# Altium schematic sheet Top_Design.SchDoc
size A4; SheetNumber: 1; SheetTotal: 4
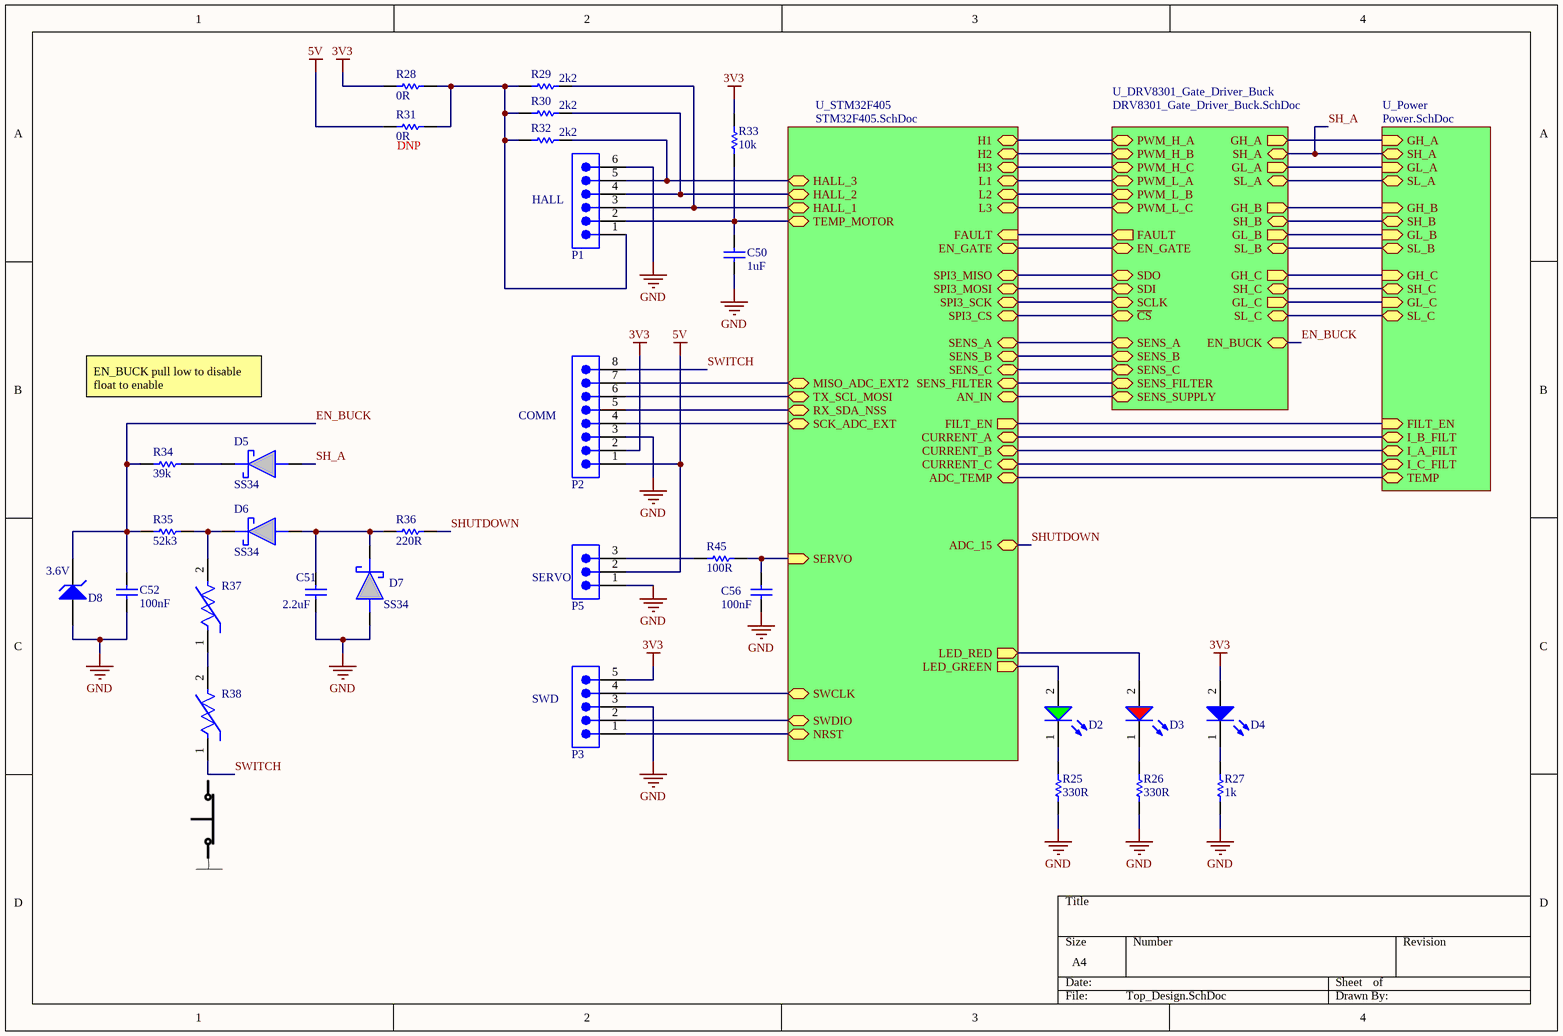
[diagram p0: Top_Design.SchDoc]

## Parts
C50  value 1uF  [Wurth 0603 capacitor]  (hidden comment: Generic Capacitor 1uF 0603)
C51  value 2.2uF  [Wurth 0603 capacitor]  (hidden comment: Generic Capacitor 2.2uF 0603)
C52  value 100nF  [Wurth 0603 capacitor]  (hidden comment: Generic Capacitor 100nF 0603)
C56  value 100nF  [Wurth 0603 capacitor]  (hidden comment: Generic Capacitor 100nF 0603)
D2  Green, 3.2V, 140°  [Wurth 0603 LED]  (value not drawn)
D3  Red, 2V, 140°  [Wurth 0603 LED]  (value not drawn)
D4  Blue, 3.2V, 140°  [Wurth 0603 LED]  (value not drawn)
D5  SS34  [MDD DO-214AC diode]
D6  SS34  [MDD DO-214AC diode]
D7  SS34  [MDD DO-214AC diode]
D8  ROHM EDZVT2R3.6B  [ROHM SOD-523 zener]  (value not drawn)
P1  61300611121  [6x1 2.54mm M]  (value not drawn)
P2  61300811121  [8x1 2.54mm M]  (value not drawn)
P3  61300511121  [5x1 2.54mm M]  (value not drawn)
P5  61300311121  [3x1 2.54mm M]  (value not drawn)
R25  value 330R  [Wurth 0603 Resistor]  (hidden comment: Generic Resistor 330R 0603)
R26  value 330R  [Wurth 0603 Resistor]  (hidden comment: Generic Resistor 330R 0603)
R27  value 1k  [Wurth 0603 Resistor]  (hidden comment: Generic Resistor 1k 0603)
R28  value 0R  [Wurth 0603 Resistor]  (hidden comment: Generic Resistor 0R 0603)
R29  value 2k2  [Wurth 0603 Resistor]  (hidden comment: Generic Resistor 2k2 0603)
R30  value 2k2  [Wurth 0603 Resistor]  (hidden comment: Generic Resistor 2k2 0603)
R31  value 0R  [Wurth 0603 Resistor]  (hidden comment: Generic Resistor 0R 0603)
R32  value 2k2  [Wurth 0603 Resistor]  (hidden comment: Generic Resistor 2k2 0603)
R33  value 10k  [Wurth 0603 Resistor]  (hidden comment: Generic Resistor 10k 0603)
R34  value 39k  [Wurth 0603 Resistor]  (hidden comment: Generic Resistor 39k 0603)
R35  value 52k3  [Wurth 0603 Resistor]  (hidden comment: Generic Resistor 52k3 0603)
R36  value 220R  [Wurth 0603 Resistor]  (hidden comment: Generic Resistor 220R 0603)
R37  PRF15BC102RB6RC  [FP-PRF15-0_05-IPC_B]  (value not drawn)
R38  PRF15BC102RB6RC  [FP-PRF15-0_05-IPC_B]  (value not drawn)
R45  value 100R  [Wurth 0603 Resistor]  (hidden comment: Generic Resistor 100R 0603)

## Sub-sheets
U_DRV8301_Gate_Driver_Buck = DRV8301_Gate_Driver_Buck.SchDoc: GH_A (out), GH_B (out), GH_C (out), GL_A (out), GL_B (out), GL_C (out), SCLK (bidir), SDI (bidir), SDO (bidir), ~{CS} (bidir), SH_A (bidir), SL_A (bidir), SL_B (bidir), SL_C (bidir), PWM_L_A (bidir), PWM_L_B (bidir), PWM_L_C (bidir), PWM_H_C (bidir), PWM_H_B (bidir), PWM_H_A (bidir), SH_C (bidir), SH_B (bidir), EN_BUCK (bidir), SENS_A (bidir), SENS_B (bidir), SENS_C (bidir), EN_GATE (bidir), SENS_FILTER (bidir), SENS_SUPPLY (bidir), FAULT (out)
U_Power = Power.SchDoc: GH_A (in), GL_A (in), GH_B (in), GL_B (in), GH_C (in), GL_C (in), SH_A (bidir), SL_A (bidir), SH_B (bidir), SL_B (bidir), SH_C (bidir), SL_C (bidir), I_A_FILT (bidir), I_B_FILT (bidir), I_C_FILT (bidir), FILT_EN (in), TEMP (bidir)
U_STM32F405 = STM32F405.SchDoc: EN_GATE (bidir), RX_SDA_NSS (bidir), L1 (bidir), L2 (bidir), L3 (bidir), SENS_A (bidir), SENS_B (bidir), SENS_C (bidir), ADC_TEMP (bidir), SCK_ADC_EXT (bidir), H1 (bidir), H2 (bidir), H3 (bidir), SWDIO (bidir), SWCLK (bidir), CURRENT_A (bidir), CURRENT_B (bidir), CURRENT_C (bidir), AN_IN (bidir), TEMP_MOTOR (bidir), ADC_15 (bidir), HALL_1 (bidir), HALL_2 (bidir), HALL_3 (bidir), SPI3_CS (bidir), SPI3_SCK (bidir), SENS_FILTER (bidir), SPI3_MOSI (bidir), SPI3_MISO (bidir), LED_GREEN (out), LED_RED (out), MISO_ADC_EXT2 (bidir), TX_SCL_MOSI (bidir), FILT_EN (out), NRST (bidir), FAULT (in), SERVO (in)

## Nets
3V3: D4.2(A) P2.2 P3.5 R28.2 R33.2
5V: P2.1 P5.2 R31.2
GND: C50.1 C51.1 C52.1 C56.1 D7.2(A) D8.2(A) P1.6 P2.3 P3.3 P5.1 R25.2 R26.2 R27.2
EN_BUCK: C52.2 D8.1(K) R34.1 R35.1 ; sheet U_DRV8301_Gate_Driver_Buck/EN_BUCK
SH_A: D5.2(A) ; sheet U_DRV8301_Gate_Driver_Buck/SH_A, sheet U_Power/SH_A
SHUTDOWN: R36.2 ; sheet U_STM32F405/ADC_15
SWITCH: P2.8 R38.1
NetC50_2: C50.2 P1.2 R33.1 ; sheet U_STM32F405/TEMP_MOTOR
NetC51_2: C51.2 D6.2(A) D7.1(K) R36.1
NetC56_2: C56.2 R45.2 ; sheet U_STM32F405/SERVO
NetD2_1: D2.1(K) R25.1
NetD2_2: D2.2(A) ; sheet U_STM32F405/LED_GREEN
NetD3_1: D3.1(K) R26.1
NetD3_2: D3.2(A) ; sheet U_STM32F405/LED_RED
NetD4_1: D4.1(K) R27.1
NetD5_1: D5.1(K) R34.2
NetD6_1: D6.1(K) R35.2 R37.2
NetP1_1: P1.1 R28.1 R29.1 R30.1 R31.1 R32.1
NetP1_3: P1.3 R29.2 ; sheet U_STM32F405/HALL_1
NetP1_4: P1.4 R30.2 ; sheet U_STM32F405/HALL_2
NetP1_5: P1.5 R32.2 ; sheet U_STM32F405/HALL_3
NetP2_4: P2.4 ; sheet U_STM32F405/SCK_ADC_EXT
NetP2_5: P2.5 ; sheet U_STM32F405/RX_SDA_NSS
NetP2_6: P2.6 ; sheet U_STM32F405/TX_SCL_MOSI
NetP2_7: P2.7 ; sheet U_STM32F405/MISO_ADC_EXT2
NetP3_1: P3.1 ; sheet U_STM32F405/NRST
NetP3_2: P3.2 ; sheet U_STM32F405/SWDIO
NetP3_4: P3.4 ; sheet U_STM32F405/SWCLK
NetP5_3: P5.3 R45.1
NetR37_1: R37.1 R38.2
(unnamed): sheet U_DRV8301_Gate_Driver_Buck/GH_A, sheet U_Power/GH_A
(unnamed): sheet U_DRV8301_Gate_Driver_Buck/GH_B, sheet U_Power/GH_B
(unnamed): sheet U_DRV8301_Gate_Driver_Buck/GH_C, sheet U_Power/GH_C
(unnamed): sheet U_DRV8301_Gate_Driver_Buck/GL_A, sheet U_Power/GL_A
(unnamed): sheet U_DRV8301_Gate_Driver_Buck/GL_B, sheet U_Power/GL_B
(unnamed): sheet U_DRV8301_Gate_Driver_Buck/GL_C, sheet U_Power/GL_C
(unnamed): sheet U_DRV8301_Gate_Driver_Buck/SCLK, sheet U_STM32F405/SPI3_SCK
(unnamed): sheet U_DRV8301_Gate_Driver_Buck/SDI, sheet U_STM32F405/SPI3_MOSI
(unnamed): sheet U_DRV8301_Gate_Driver_Buck/SDO, sheet U_STM32F405/SPI3_MISO
(unnamed): sheet U_DRV8301_Gate_Driver_Buck/~{CS}, sheet U_STM32F405/SPI3_CS
(unnamed): sheet U_DRV8301_Gate_Driver_Buck/SL_A, sheet U_Power/SL_A
(unnamed): sheet U_DRV8301_Gate_Driver_Buck/SL_B, sheet U_Power/SL_B
(unnamed): sheet U_DRV8301_Gate_Driver_Buck/SL_C, sheet U_Power/SL_C
(unnamed): sheet U_DRV8301_Gate_Driver_Buck/PWM_L_A, sheet U_STM32F405/L1
(unnamed): sheet U_DRV8301_Gate_Driver_Buck/PWM_L_B, sheet U_STM32F405/L2
(unnamed): sheet U_DRV8301_Gate_Driver_Buck/PWM_L_C, sheet U_STM32F405/L3
(unnamed): sheet U_DRV8301_Gate_Driver_Buck/PWM_H_C, sheet U_STM32F405/H3
(unnamed): sheet U_DRV8301_Gate_Driver_Buck/PWM_H_B, sheet U_STM32F405/H2
(unnamed): sheet U_DRV8301_Gate_Driver_Buck/PWM_H_A, sheet U_STM32F405/H1
(unnamed): sheet U_DRV8301_Gate_Driver_Buck/SH_C, sheet U_Power/SH_C
(unnamed): sheet U_DRV8301_Gate_Driver_Buck/SH_B, sheet U_Power/SH_B
(unnamed): sheet U_DRV8301_Gate_Driver_Buck/SENS_A, sheet U_STM32F405/SENS_A
(unnamed): sheet U_DRV8301_Gate_Driver_Buck/SENS_B, sheet U_STM32F405/SENS_B
(unnamed): sheet U_DRV8301_Gate_Driver_Buck/SENS_C, sheet U_STM32F405/SENS_C
(unnamed): sheet U_DRV8301_Gate_Driver_Buck/EN_GATE, sheet U_STM32F405/EN_GATE
(unnamed): sheet U_DRV8301_Gate_Driver_Buck/SENS_FILTER, sheet U_STM32F405/SENS_FILTER
(unnamed): sheet U_DRV8301_Gate_Driver_Buck/SENS_SUPPLY, sheet U_STM32F405/AN_IN
(unnamed): sheet U_DRV8301_Gate_Driver_Buck/FAULT, sheet U_STM32F405/FAULT
(unnamed): sheet U_Power/I_A_FILT, sheet U_STM32F405/CURRENT_B
(unnamed): sheet U_Power/I_B_FILT, sheet U_STM32F405/CURRENT_A
(unnamed): sheet U_Power/I_C_FILT, sheet U_STM32F405/CURRENT_C
(unnamed): sheet U_Power/FILT_EN, sheet U_STM32F405/FILT_EN
(unnamed): sheet U_Power/TEMP, sheet U_STM32F405/ADC_TEMP

## Notes on the sheet
- (near R31) DNP
- HALL
- EN_BUCK pull low to disable
  float to enable
- COMM
- (near D8) 3.6V
- (near P5) SERVO
- (near P3) SWD

## Library data of the parts
D2 = LED GREEN 0603: WL-SMCD Mono-color Chip LED Diffused, SMT, size 0603, Green, 3.2V, 140°; Manufacturer Part Number: 150060GS55040; Manufacturer: Wurth Elektronik; Case/Size Code: 0603; Chip Technology: InGaN; Dominant Wavelength: 525nm; Luminous Intensity: 430mcd; Peak Wavelength: 520nm; Category: Signal LEDs; Match Code: WL-SMCD; ComponentLink1Description: Website Link; ComponentLink1URL: https://www.we-online.com/redexpert/article/150060GS55040?ad; ComponentLink2Description: Datasheet Link; ComponentLink2URL: https://www.we-online.com/redexpert/spec/150060GS55040?ad; Mount: Surface Mount; Operating Temperature Max: 85°C; Operating Temperature Min: -40°C; Packaging: Tape and Reel; Length: 1.6mm; Width: 0.8mm; Height: 0.4mm; Emitting Color: Green; Forward Voltage: 3.2V; Viewing Angle: 140°
D3 = LED RED 0603: WL-SMCD Mono-color Chip LED Diffused, SMT, size 0603, Red, 2V, 140°; Manufacturer Part Number: 150060RS55040; Manufacturer: Wurth Elektronik; Case/Size Code: 0603; Chip Technology: AlInGaP; Dominant Wavelength: 624nm; Luminous Intensity: 90mcd; Peak Wavelength: 632nm; Category: Signal LEDs; Match Code: WL-SMCD; ComponentLink1Description: Website Link; ComponentLink1URL: https://www.we-online.com/redexpert/article/150060RS55040?ad; ComponentLink2Description: Datasheet Link; ComponentLink2URL: https://www.we-online.com/redexpert/spec/150060RS55040?ad; Mount: Surface Mount; Operating Temperature Max: 85°C; Operating Temperature Min: -40°C; Packaging: Tape and Reel; Length: 1.6mm; Width: 0.8mm; Height: 0.4mm; Emitting Color: Red; Forward Voltage: 2V; Viewing Angle: 140°
D4 = LED BLUE 0603: WL-SMCD Mono-color Chip LED Diffused, SMT, size 0603, Blue, 3.2V, 140°; Manufacturer Part Number: 150060BS55040; Manufacturer: Wurth Elektronik; Case/Size Code: 0603; Chip Technology: InGaN; Dominant Wavelength: 470nm; Luminous Intensity: 80mcd; Peak Wavelength: 465nm; Category: Signal LEDs; Match Code: WL-SMCD; ComponentLink1Description: Website Link; ComponentLink1URL: https://www.we-online.com/redexpert/article/150060BS55040?ad; ComponentLink2Description: Datasheet Link; ComponentLink2URL: https://www.we-online.com/redexpert/spec/150060BS55040?ad; Mount: Surface Mount; Operating Temperature Max: 85°C; Operating Temperature Min: -40°C; Packaging: Tape and Reel; Length: 1.6mm; Width: 0.8mm; Height: 0.4mm; Emitting Color: Blue; Forward Voltage: 3.2V; Viewing Angle: 140°
D5-D7 = MDD SS34: SS34 Schottky Barrier Diodes (SBD) SMA(DO-214AC) RoHS; Manufacturer_Name: MDD; Geometry.Height: 2.44mm; Manufacturer_Part_Number: SS34; Mouser Part Number: *; Mouser Price/Stock: *; Arrow Part Number: *; Arrow Price/Stock: *; Datasheet Link: https://datasheet.lcsc.com/szlcsc/MDD-Jiangsu-Yutai-Elec-SS34_C13762.pdf
D8 = 3.6V 150mW zener: Independent 3.6V~3.845V 150mW 3.6V SOD-523 Zener Diodes ROHS
P1 = 6P: WR-PHD Pin Header, THT, Vertical, pitch 2.54mm, 1 Row, 6P; Manufacturer: Wurth Elektronik; Contact Resistance: 20mOhm; Rated Current: 3A; Working Voltage: 250V; Withstanding Voltage: 500V; Manufacturer Part Number: 61300611121; Category: Board-to-Board Connectors; Match Code: WR-PHD; ComponentLink1Description: Website Link; ComponentLink1URL: https://www.we-online.com/redexpert/article/61300611121?ad; ComponentLink2Description: Datasheet Link; ComponentLink2URL: https://www.we-online.com/redexpert/spec/61300611121?ad; Mount: Through Hole; Operating Temperature Max: 105°C; Operating Temperature Min: -40°C; Packaging: Bag; Gender: Pin Header; Number of Pins: 6; Number of Rows: 1; Orientation: Vertical; Pitch: 2.54mm
P2 = 8P: WR-PHD Pin Header, THT, Vertical, pitch 2.54mm, 1 Row, 8P; Manufacturer: Wurth Elektronik; Contact Resistance: 20mOhm; Rated Current: 3A; Working Voltage: 250V; Withstanding Voltage: 500V; Manufacturer Part Number: 61300811121; Category: Board-to-Board Connectors; Match Code: WR-PHD; ComponentLink1Description: Website Link; ComponentLink1URL: https://www.we-online.com/redexpert/article/61300811121?ad; ComponentLink2Description: Datasheet Link; ComponentLink2URL: https://www.we-online.com/redexpert/spec/61300811121?ad; Mount: Through Hole; Operating Temperature Max: 105°C; Operating Temperature Min: -40°C; Packaging: Bag; Gender: Pin Header; Number of Pins: 8; Number of Rows: 1; Orientation: Vertical; Pitch: 2.54mm
P3 = 5P: WR-PHD Pin Header, THT, Vertical, pitch 2.54mm, 1 Row, 5P; Manufacturer: Wurth Elektronik; Contact Resistance: 20mOhm; Rated Current: 3A; Working Voltage: 250V; Withstanding Voltage: 500V; Manufacturer Part Number: 61300511121; Category: Board-to-Board Connectors; Match Code: WR-PHD; ComponentLink1Description: Website Link; ComponentLink1URL: https://www.we-online.com/redexpert/article/61300511121?ad; ComponentLink2Description: Datasheet Link; ComponentLink2URL: https://www.we-online.com/redexpert/spec/61300511121?ad; Mount: Through Hole; Operating Temperature Max: 105°C; Operating Temperature Min: -40°C; Packaging: Bag; Gender: Pin Header; Number of Pins: 5; Number of Rows: 1; Orientation: Vertical; Pitch: 2.54mm
P5 = 3P: WR-PHD Pin Header, THT, Vertical, pitch 2.54mm, 1 Row, 3P; Manufacturer: Wurth Elektronik; Contact Resistance: 20mOhm; Rated Current: 3A; Working Voltage: 250V; Withstanding Voltage: 500V; Manufacturer Part Number: 61300311121; Category: Board-to-Board Connectors; Match Code: WR-PHD; ComponentLink1Description: Website Link; ComponentLink1URL: https://www.we-online.com/redexpert/article/61300311121?ad; ComponentLink2Description: Datasheet Link; ComponentLink2URL: https://www.we-online.com/redexpert/spec/61300311121?ad; Mount: Through Hole; Operating Temperature Max: 105°C; Operating Temperature Min: -40°C; Packaging: Bag; Gender: Pin Header; Number of Pins: 3; Number of Rows: 1; Orientation: Vertical; Pitch: 2.54mm
R37 R38 = CMP-06022-000468-1: THERMISTOR PTC 1K OHM 50% 0402; Voltage: 32V; Resistance: 1kR; Case Code (Metric): 1005; Packaging: Tape and Reel; Depth: 0.5mm; Case Code (Imperial): 0402; Length: 1mm; Case/Package: 0402; Number of Pins: 2; Tolerance: 50%; Height: 0.5mm; Min Operating Temperature: -40°C; Mount: Surface Mount; Max Operating Temperature: 130°C; Width: 0.5mm; Termination: SMD/SMT; Package Quantity: 10000